# Altium schematic sheet uController.SchDoc: uController.SchDoc
size A4; DocumentNumber: 3; SheetNumber: 2; SheetTotal: 4; PageSetup: Record=PageOptions|CenterHorizontal=True|CenterVertical=True|PrintScale=0.73|XCorrection=1.00|YCorrection=1.00|PrintKind=1|BorderSize=5000000|LeftOffset=0|BottomOffset=0|Orientation=2|PaperLength=1000|PaperWidth=1000|Scale=100|PaperSource=257|PrintQuality=1200|MediaType=1|DitherType=10|PaperKind=A4|PrintScaleMode=1
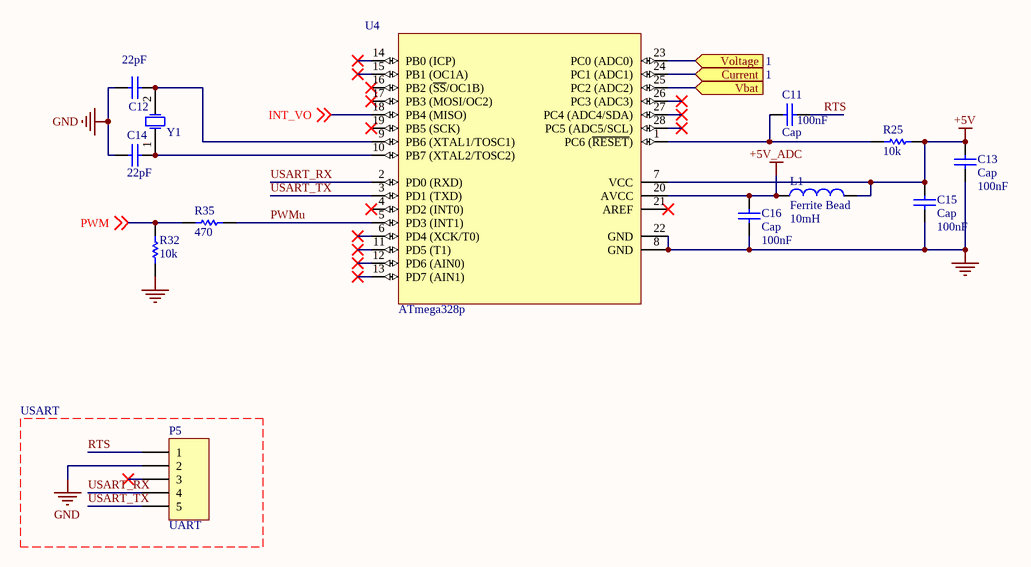
[diagram p0: uController.SchDoc]

## Parts
C11  Cap  value 100nF  [6-0805_M]
C12  22pF  [C0805]
C13  Cap  value 100nF  [C1210_M]
C14  22pF  [C0805]
C15  Cap  value 100nF  [6-0805_M]
C16  Cap  value 100nF  [6-0805_M]
L1  Ferrite Bead  value 10mH  [6-0805_M]
P5  UART  [HDR1X5]
R25  value 10k  [6-0805_M]  (hidden comment: Res1)
R32  value 10k  [6-0805_M]  (hidden comment: Res1)
R35  470  [6-0805_M]
U4  ATmega328p  [28P3]
Y1  (no value)  [HC-49U]

## Ports
Current (in, see 1), Vbat (in), Voltage (in, see 1)

## Nets
+5V: C13.1 C15.1 L1.2 R25.2 U4.7(VCC)
+5V_ADC: C16.1 L1.1 U4.20(AVCC)
GND: C12.1 C13.2 C14.1 C15.2 C16.2 P5.2 R32.1 U4.8(GND) U4.22(GND)
Current: U4.24(PC1_(ADC1)) ; port Current
INT_VO: U4.18(PB4_(MISO)) ; off-sheet INT_VO
PWM: R32.2 R35.1 ; off-sheet PWM
PWMu: R35.2 U4.5(PD3_(INT1))
RTS: C11.2 P5.1
USART_RX: P5.4 U4.2(PD0_(RXD))
USART_TX: P5.5 U4.3(PD1_(TXD))
Vbat: U4.25(PC2_(ADC2)) ; port Vbat
Voltage: U4.23(PC0_(ADC0)) ; port Voltage
NetC11_1: C11.1 R25.1 U4.1(PC6_(~{RESET}))
NetC12_2: C12.2 U4.9(PB6_(XTAL1/TOSC1)) Y1.2(OSC2)
NetC14_2: C14.2 U4.10(PB7_(XTAL2/TOSC2)) Y1.1(OSC1)

Not connected (* = marked no-connect by the designer): P5 3*; U4 4(PD2_(INT0))* 6(PD4_(XCK/T0))* 11(PD5_(T1))* 12(PD6_(AIN0))* 13(PD7_(AIN1))* 14(PB0_(ICP))* 15(PB1_(OC1A))* 16(PB2_(~{SS}/OC1B))* 17(PB3_(MOSI/OC2))* 19(PB5_(SCK))* 21(AREF)* 26(PC3_(ADC3))* 27(PC4_(ADC4/SDA))* 28(PC5_(ADC5/SCL))*

## Notes on the sheet
- USART

## Library data of the parts
C11 C13 C15 C16 = Cap: Capacitor; Published: 8-Jun-2000; LatestRevisionDate: 17-Jul-2002; LatestRevisionNote: Re-released for DXP Platform.; PackageReference: RAD-0.3; Publisher: Altium Limited; PackageDescription: Radial Cap, Thru-Hole; 2 Leads; 0.3 in Pin Spacing
C12 C14 = Cap Semi: Capacitor (Semiconductor SIM Model); Published: 8-Jun-2000; LatestRevisionDate: 29-May-2009; LatestRevisionNote: IPC-7351 Footprint Added.; PackageReference: C1206; Publisher: Altium Limited; PackageDescription: Chip Capacitor; Value: 22pF
L1 = Inductor: Code_IEC: 1005; Published: 8-Jun-2000; LatestRevisionDate: 29-May-2009; LatestRevisionNote: IPC-7351 Footprint Added.; PackageReference: 0402-A; Publisher: Altium Limited; PackageDescription: Chip Inductor; Code_JEITA: 0402
P5 = Header 5: Header, 5-Pin; LatestRevisionDate: 17-Jul-2002; LatestRevisionNote: Re-released for DXP Platform.; Publisher: Altium Limited
R25 R32 R35 = Res1: Resistor; Published: 8-Jun-2000; LatestRevisionDate: 17-Jul-2002; LatestRevisionNote: Re-released for DXP Platform.; PackageReference: AXIAL-0.3; Publisher: Altium Limited; PackageDescription: Axial Device, Thru-Hole; 2 Leads; 0.3 in Pin Spacing
  R35: Value: 470
U4 = ATmega8-16PI: 8-Bit AVR Microcontroller with 8K Bytes of In-System Programmable Flash Memory; Published: 17-Sep-2003; LatestRevisionDate: 04-Mar-2005; LatestRevisionNote: Stylized 3D Model Added.; DatasheetVersion: 2486H-AVR-09/02; PackageVersion: revB, Sep-2001; PackageReference: 28P3; Publisher: Altium Limited; PackageDescription: DIP; 28 Leads; Row Spacing 7.62 mm; Pitch 2.54 mm; ComponentLink1Description: Manufacturer Link; ComponentLink1URL: http://www.atmel.com; ComponentLink2Description: Datasheet; ComponentLink2URL: http://www.atmel.com/dyn/resources/prod_documents/doc2486.pdf
Y1 = Crystal: Crystal Oscillator